# Altium schematic sheet Servo_Driver.SchDoc
size A
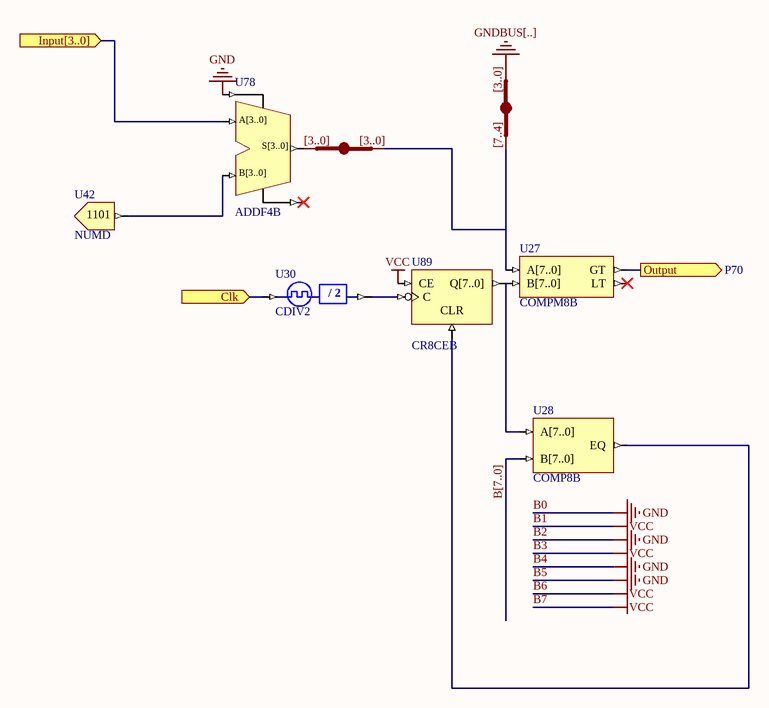
[diagram p0: Servo_Driver.SchDoc]

## Parts
(Parts that share a designator on the sheet are numbered #1, #2 ... from top to bottom, then left to right.)
JB_AUTO?#1  IndexA: [7..4]  IndexB: [3..0]  (hidden comment: JB)
JB_AUTO?#2  IndexA: [3..0]  (hidden comment: JB)
U27  COMPM8B
U28  COMP8B
U30  CDIV2
U42  NUMD
U78  ADDF4B
U89  CR8CEB

## Ports
Clk (in), Input[3..0] (in), Output (out, see P70)

## Nets
B0: U78.CI  [also labelled B2, B4, B5, GND]
B1: U89.CE  [also labelled B3, B6, B7, VCC]
GNDBUS[..]: JB_AUTO?#1.B[0..0]
B[7..0]: U28.B[7..0]
Clk: U30.CLKIN ; port Clk
Input[3..0]: U78.A[3..0] ; port Input[3..0]
Output: U27.GT ; port Output
NetJB_AUTO?#1_A[0..0]: JB_AUTO?#1.A[0..0] JB_AUTO?#2.B[0..0] U27.A[7..0]
NetJB_AUTO?#2_A[0..0]: JB_AUTO?#2.A[0..0] U78.S[3..0]
NetU27_B[7..0]: U27.B[7..0] U28.A[7..0] U89.Q[7..0]
NetU28_EQ: U28.EQ U89.CLR
NetU30_CLKDV: U30.CLKDV U89.C
NetU42_O[3..0]: U42.O[3..0] U78.B[3..0]

Not connected (* = marked no-connect by the designer): U27 LT*; U78 CO*

## Buses and harness runs
bus B[7..0]

## Notes on the sheet
- (in symbol CDIV2) / 2
- (in symbol NUMD) 1101

## Library data of the parts
JB_AUTO?#1 JB_AUTO?#2 = JB: System BUS Joiner; Published: 29-Jan-2004; Publisher: Altium Limited; LastRevisionNo: 1.00.00; HelpURL: CR0118 FPGA Generic Library Guide.pdf#page=297; FunctionalClass: Bus Joiner
  JB_AUTO?#2: IndexB: [3..0]
U27 = COMPM8B: 8-Bit Magnitude Comparator, Bus Version; XilinxEquivalent: COMPM8; SubClass: COMPM; PortSize: 8; ArchiveName: GENERIC; VHDLIB_SIM: GENERIC_LIB; Published: 29-Jan-2004; Publisher: Altium Limited; LastRevisionNo: 1.00.00; HelpURL: CR0118 FPGA Generic Library Guide.pdf#page=153; ComponentLink1URL: CR0129 FPGA Comparator Resource Usage.pdf#page=37; ComponentLink1Description: Core &Resource Usage; FunctionalClass: Comparator; PortStyle: Bus Version
U28 = COMP8B: 8-Bit Identity Comparator, Bus Version; XilinxEquivalent: COMP8; SubClass: COMP; PortSize: 8; ArchiveName: GENERIC; VHDLIB_SIM: GENERIC_LIB; Published: 29-Jan-2004; Publisher: Altium Limited; LastRevisionNo: 1.00.00; HelpURL: CR0118 FPGA Generic Library Guide.pdf#page=151; ComponentLink1URL: CR0129 FPGA Comparator Resource Usage.pdf#page=14; ComponentLink1Description: Core &Resource Usage; FunctionalClass: Comparator; PortStyle: Bus Version
U30 = CDIV2: Clock Divider by 2; DivisorRate: 2; ArchiveName: GENERIC; VHDLIB_SIM: GENERIC_LIB; Published: 29-Jan-2004; Publisher: Altium Limited; LastRevisionNo: 1.00.00; HelpURL: CR0118 FPGA Generic Library Guide.pdf#page=142; ComponentLink1URL: CR0127 FPGA Clock Divider Resource Usage.pdf#page=2; ComponentLink1Description: Core &Resource Usage; FunctionalClass: Clock Divider
U42 = NUMD: Number Connector D; FunctionalClass: Numeric Connector; PortSize: 4; PortStyle: Bus Version; ArchiveName: GENERIC; VHDLIB_SIM: GENERIC_LIB; Published: 29-Jan-2004; Publisher: Altium Limited; LastRevisionNo: 1.00.00; HelpURL: CR0118 FPGA Generic Library Guide.pdf#page=409; ComponentLink1URL: CR0138 FPGA Numeric Connector Resource Usage.pdf#page=15; ComponentLink1Description: Core &Resource Usage; SubClass: D
U78 = ADDF4B: 4-Bit Cascadable Unsigned Binary Full Adder, Bus Version; FunctionalClass: Arithmetic Function; SubClass: ADDF; PortSize: 4; ArchiveName: GENERIC; VHDLIB_SIM: GENERIC_LIB; Published: 29-Jan-2004; Publisher: Altium Limited; LastRevisionNo: 1.00.00; HelpURL: CR0118 FPGA Generic Library Guide.pdf#page=100; ComponentLink1URL: CR0124 FPGA Arithmetic Function Resource Usage.pdf#page=21; ComponentLink1Description: Core &Resource Usage; PortStyle: Bus Version
U89 = CR8CEB: 8-Bit Negative-Edge Binary Ripple Counters with Clock Enable and Asynchronous Clear, Bus Version; XilinxEquivalent: CR8CE; ClockTrigger: Falling; Enable: High; PortSize: 8; ArchiveName: GENERIC; VHDLIB_SIM: GENERIC_LIB; Published: 29-Jan-2004; Publisher: Altium Limited; LastRevisionNo: 1.00.00; HelpURL: CR0118 FPGA Generic Library Guide.pdf#page=156; ComponentLink1URL: CR0130 FPGA Counter Resource Usage.pdf#page=82; ComponentLink1Description: Core &Resource Usage; FunctionalClass: Counter; SubClass: Ripple; Reset: Asynchronous; PortType: Bus Version